# Altium schematic sheet TOP.SchDoc
size A4
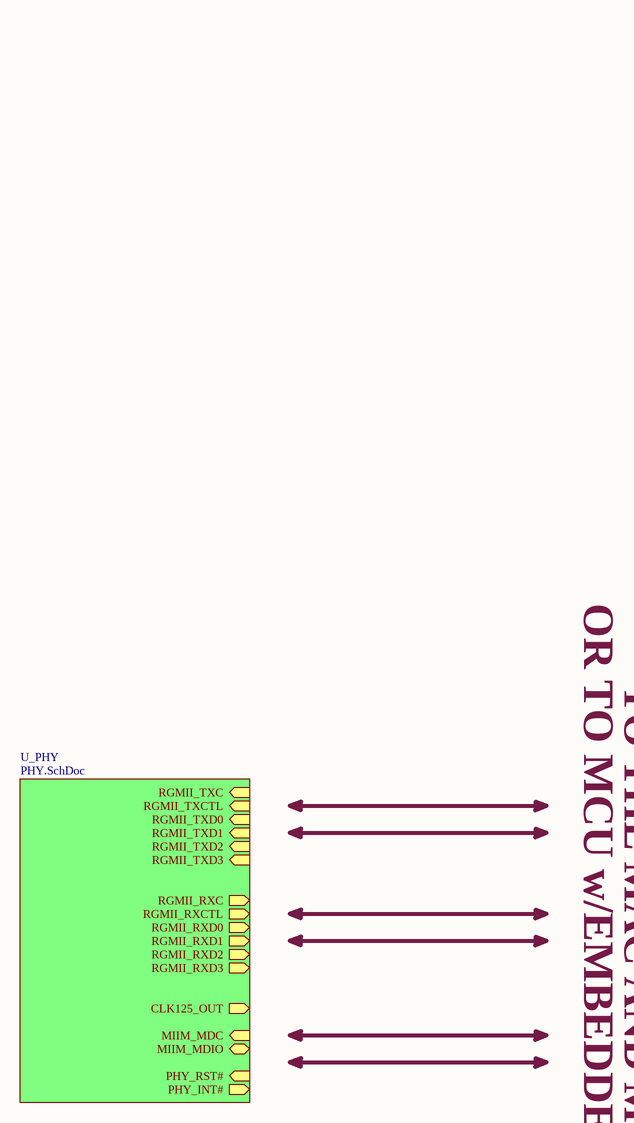
[diagram p0: TOP.SchDoc]

## Sub-sheets
U_PHY = PHY.SchDoc: RGMII_RXC (out), RGMII_RXCTL (out), RGMII_RXD0 (out), RGMII_RXD1 (out), RGMII_RXD2 (out), RGMII_RXD3 (out), CLK125_OUT (out), RGMII_TXC (in), RGMII_TXCTL (in), RGMII_TXD0 (in), RGMII_TXD1 (in), RGMII_TXD2 (in), RGMII_TXD3 (in), MIIM_MDC (in), MIIM_MDIO (bidir), PHY_RST# (in), PHY_INT# (out)

## Notes on the sheet
- OR TO MCU w/EMBEDDED MAC
- TO THE MAC AND MCU